# EAGLE design Nano_Wearable_Shield (EAGLE 9.1.3)
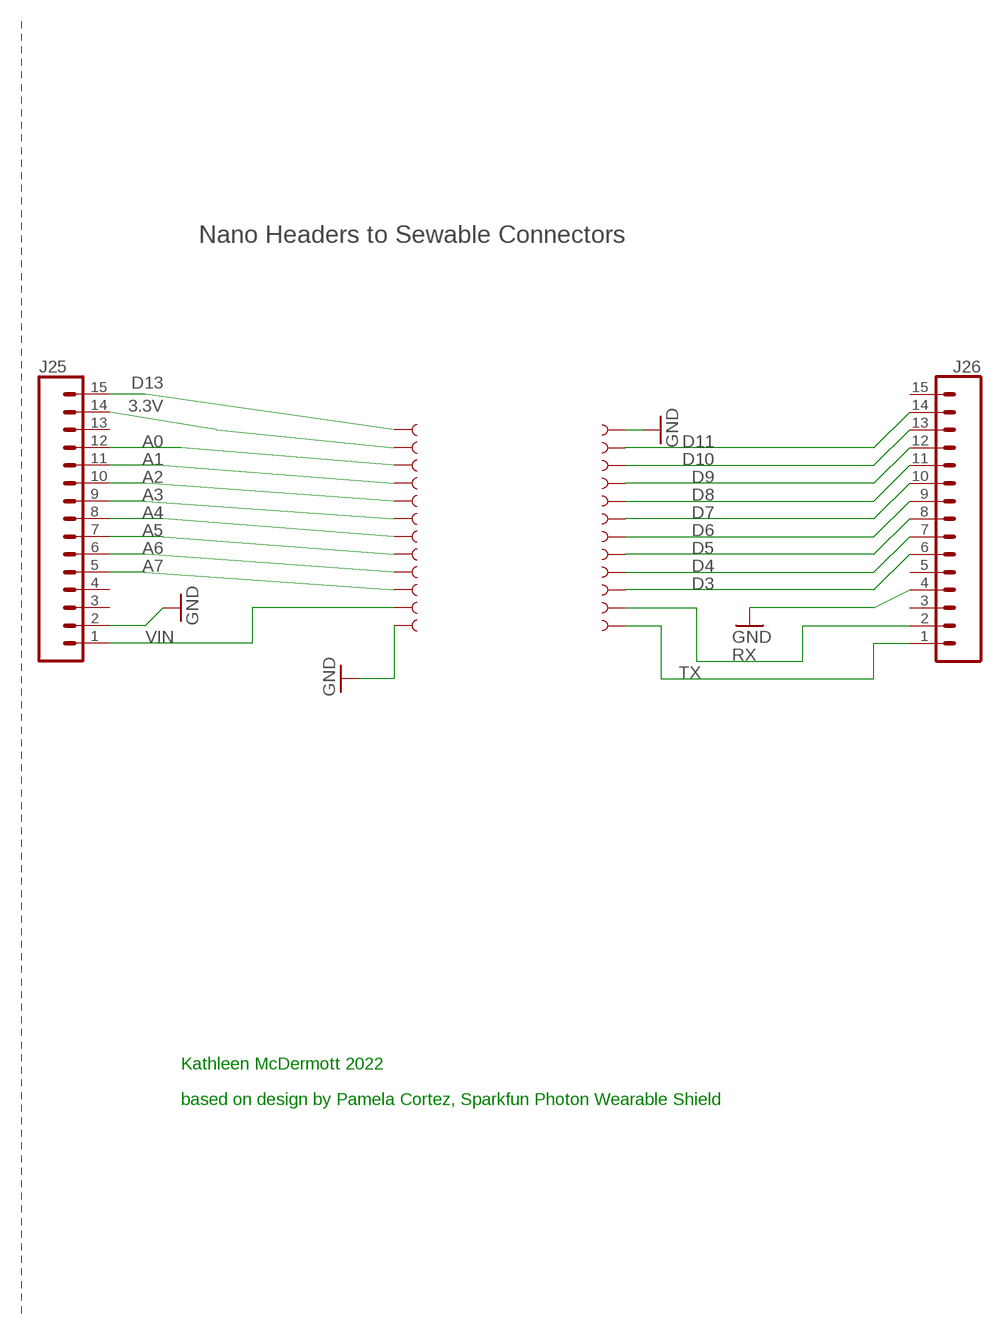
[diagram p0: schematic, sheet 1]

## Parts
J1  PAD  [PAD-LONG-2-SIDED]
J2  PAD  [PAD-LONG-2-SIDED]
J3  PAD  [PAD-LONG-2-SIDED]
J4  PAD  [PAD-LONG-2-SIDED]
J5  PAD  [PAD-LONG-2-SIDED]
J6  PAD  [PAD-LONG-2-SIDED]
J7  PAD  [PAD-LONG-2-SIDED]
J8  PAD  [PAD-LONG-2-SIDED]
J9  PAD  [PAD-LONG-2-SIDED]
J10  PAD  [PAD-LONG-2-SIDED]
J11  PAD  [PAD-LONG-2-SIDED]
J12  PAD  [PAD-LONG-2-SIDED]
J13  PAD  [PAD-LONG-2-SIDED]
J14  PAD  [PAD-LONG-2-SIDED]
J15  PAD  [PAD-LONG-2-SIDED]
J16  PAD  [PAD-LONG-2-SIDED]
J17  PAD  [PAD-LONG-2-SIDED]
J18  PAD  [PAD-LONG-2-SIDED]
J19  PAD  [PAD-LONG-2-SIDED]
J20  PAD  [PAD-LONG-2-SIDED]
J21  PAD  [PAD-LONG-2-SIDED]
J22  PAD  [PAD-LONG-2-SIDED]
J23  PAD  [PAD-LONG-2-SIDED]
J24  PAD  [PAD-LONG-2-SIDED]
J25  CONN_15  [1X15]
J26  CONN_15  [1X15]

## Nets
3.3V: J2.1 J25.14
A0: J3.1 J25.12
A1: J4.1 J25.11
A2: J5.1 J25.10
A3: J6.1 J25.9
A4: J7.1 J25.8
A5: J8.1 J25.7
A6: J9.1 J25.6
A7: J10.1 J25.5
D3: J22.1 J26.6
D4: J21.1 J26.7
D5: J20.1 J26.8
D6: J19.1 J26.9
D7: J18.1 J26.10
D8: J17.1 J26.11
D9: J16.1 J26.12
D10: J15.1 J26.13
D11: J14.1 J26.14
D13: J1.1 J25.15
GND: J12.1 J13.1 J25.2 J26.4
RX: J23.1 J26.2
TX: J24.1 J26.1
VIN: J11.1 J25.1
Unconnected: J25.3 J25.4 J25.13 J26.3 J26.5 J26.15

## Notes on the sheet
- Nano Headers to Sewable Connectors
- Kathleen McDermott 2022
- based on design by Pamela Cortez, Sparkfun Photon Wearable Shield

## Library data of the parts
J1-J24 = Photon_wearable:PAD
J25 J26 = SparkFun-Connectors:CONN_15: Multi connection point. Often used as Generic Header-pin footprint for 0.1 inch spaced/style header connections On any of the 0.1 inch spaced packages, you can populate with these: Break Away Headers - Straight <https://www.sparkfun.com/products/116> (PRT-00116) Break Away Male Headers - Right Angle <https://www.sparkfun.com/products/553> (PRT-00553) Female Headers <https://www.sparkfun.com/products/115> (PRT-00115) Break Away Headers - Machine Pin <https://www.sparkfun.com/products/117> (PRT-00117) Break Away Female Headers - Swiss Machine Pin <https://www.sparkfun.com/products/743> (PRT-00743) For SCREWTERMINALS and SPRING TERMINALS visit here: Screw Terimnals on SparkFun.com <https://www.sparkfun.com/search/results?term=Screw+Terminals> (5mm/3.5mm/2.54mm spacing) This device is also useful as a general connection point to wire up your design to another part of your project. Our various solder wires solder well into these plated through hole pads. Hook-Up Wire - Assortment (Stranded, 22 AWG) <https://www.sparkfun.com/products/11375> (PRT-11375) Hook-Up Wire - Assortment (Solid Core, 22 AWG) <https://www.sparkfun.com/products/11367> (PRT-11367) View the entire wire category on our website here <https://www.sparkfun.com/categories/141> Special notes: Molex polarized connector foot print use with SKU : PRT-08231 with associated crimp pins and housings. 1MM SMD Version SKU: PRT-10208 NOTES ON THE VARIANTS LOCK and LOCK_LONGPADS... This footprint was designed to help hold the alignment of a through-hole component (i.e. 6-pin header) while soldering it into place. You may notice that each hole has been shifted either up or down by 0.005 of an inch from it's more standard position (which is a perfectly straight line). This slight alteration caused the pins (the squares in the middle) to touch the edges of the holes. Because they are alternating, it causes a "brace" to hold the component in place. 0.005 has proven to be the perfect amount of "off-center" position when using our standard breakaway headers. Although looks a little odd when you look at the bare footprint, once you have a header in there, the alteration is very hard to notice. Also,if you push a header all the way into place, it is covered up entirely on the bottom side.

## Board
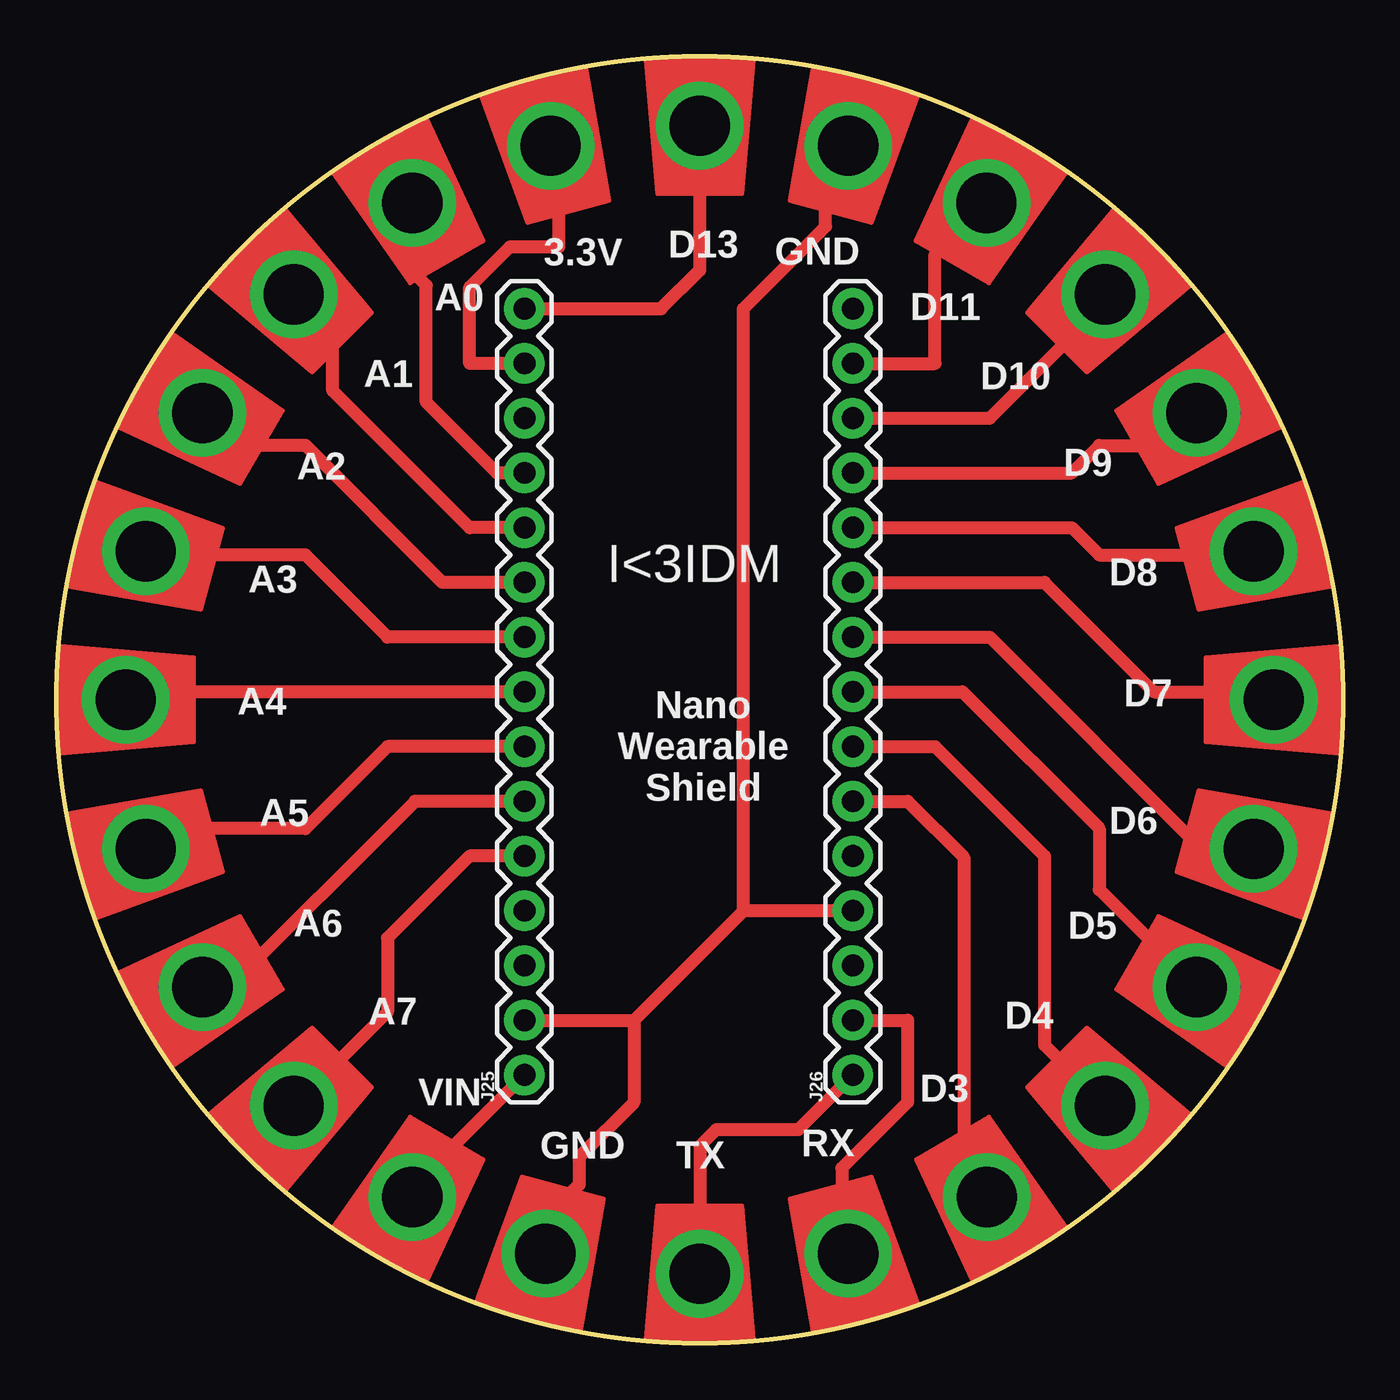
[diagram p1: board, top side]
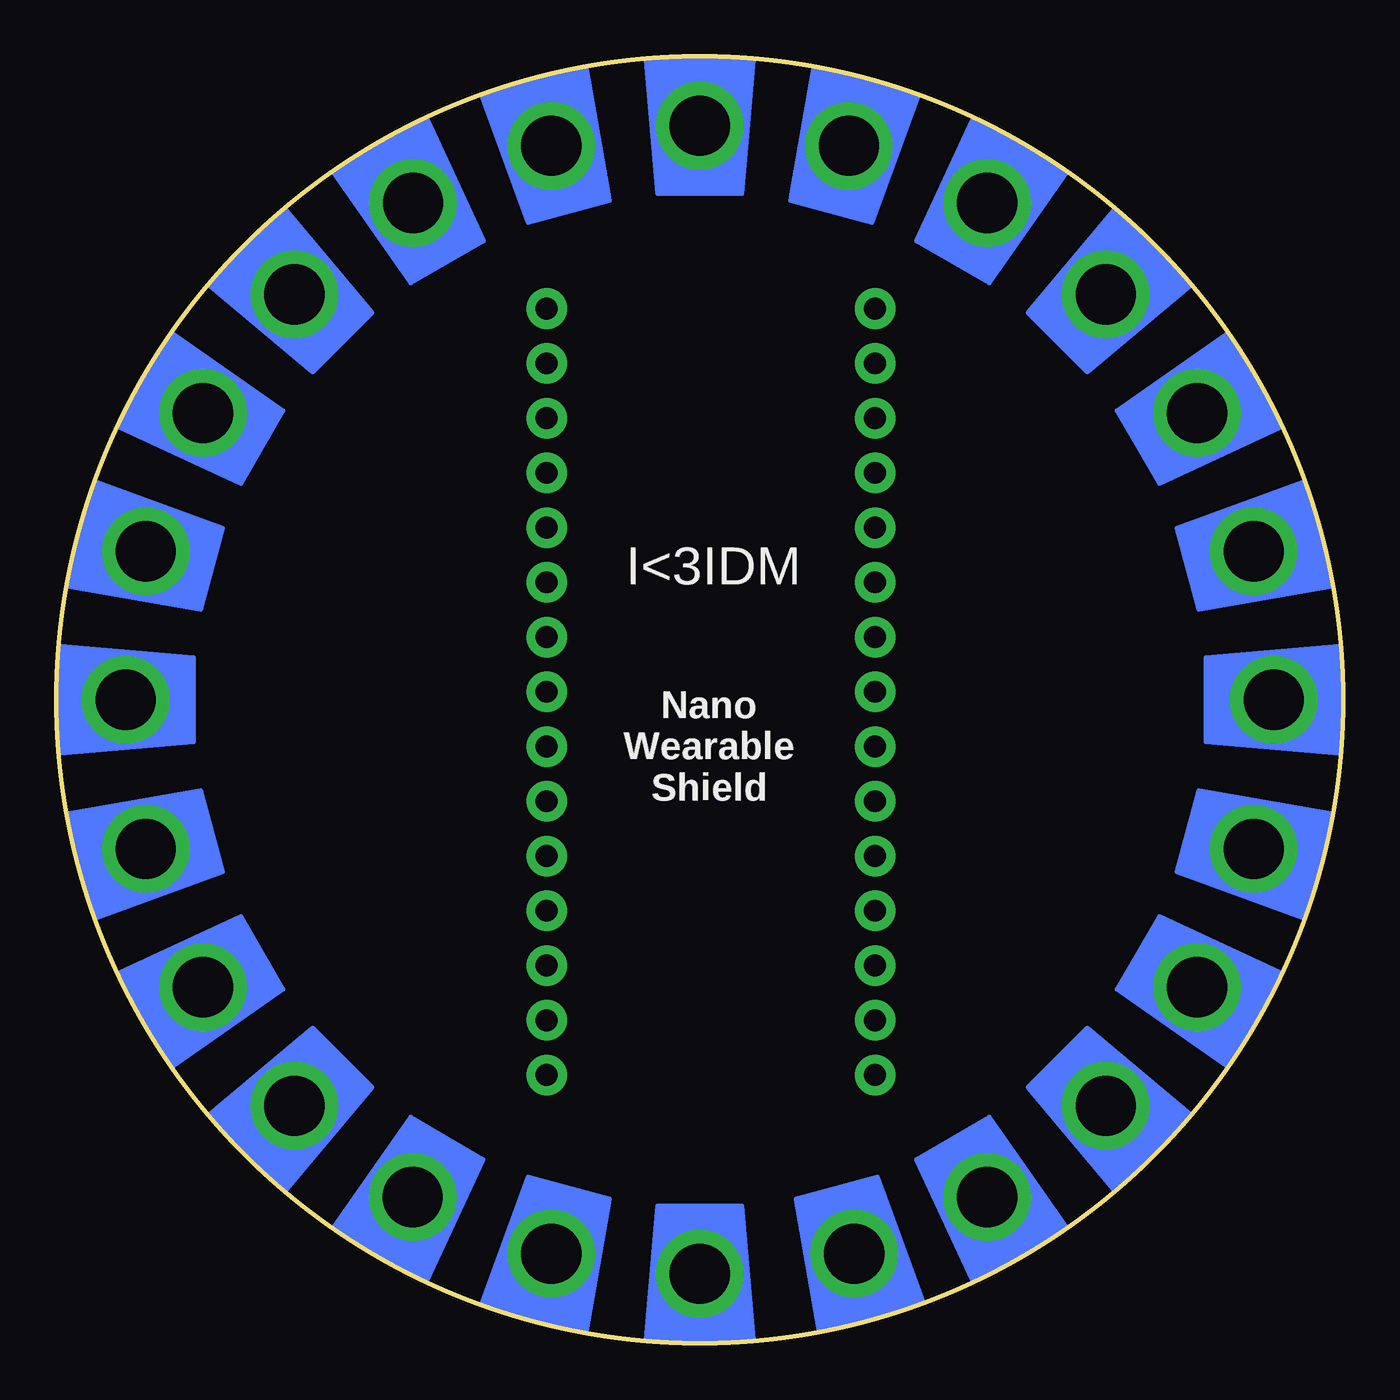
[diagram p2: board, bottom side, seen from below]

Size 59.69 x 59.69 mm. Coordinates in mm from the lower left corner, seen from the top.
Outline: circle at 29.84,29.84 radius 29.84
Copper layers (1*16): Top 0.035mm / dielectric 1.5mm / Bottom 0.035mm
Design rules "default *": minimum track width 10mil, minimum drill 24mil, track to track 8mil, track to pad 8mil, pad to pad 8mil, via to via 8mil, smd to smd 8mil, copper to edge 40mil, drill to drill 8mil, minimum pad ring 10mil, minimum via ring 8mil, stop-mask expansion 4mil, vias tented up to drill 0mil, thermal gap 10mil

### Footprints (pad centres in the part's own frame; a part is rotated, then mirrored left to right if it is on the bottom)
PAD-LONG-2-SIDED = drill 2.794 pad 4.064: 1 3.205,0
1X15 = drill 1.016 pad 1.88: 1 0,0; 2 2.54,0; 3 5.08,0; 4 7.62,0; 5 10.16,0; 6 12.7,0; 7 15.24,0; 8 17.78,0; 9 20.32,0; 10 22.86,0; 11 25.4,0; 12 27.94,0; 13 30.48,0; 14 33.02,0; 15 35.56,0

### Placement (x,y rotation side)
J1  29.84,59.69 270 top
J2  22.1,58.65 285 top
J3  14.91,55.68 300 top
J4  8.74,50.93 315 top
J5  3.99,44.75 330 top
J6  1.04,37.57 345 top
J7  0,29.84 0 top
J8  1.04,22.1 15 top
J9  3.99,14.91 30 top
J10  8.74,8.74 45 top
J11  14.91,3.99 60 top
J12  21.84,1.04 75 top
J13  37.57,58.65 255 top
J14  44.75,55.68 240 top
J15  50.93,50.93 225 top
J16  55.68,44.75 210 top
J17  58.65,37.57 195 top
J18  59.69,29.84 180 top
J19  58.65,22.1 165 top
J20  55.68,14.91 150 top
J21  50.93,8.74 135 top
J22  44.77,3.99 120 top
J23  37.57,1.04 105 top
J24  29.84,0 90 top
J25  21.71,12.43 90 top
J26  36.95,12.43 90 top

### Tracks (layer width: path | path; a pad name or v marks a point on that pad's centre or on a via)
3.3V
  Top 0.61: J25.14 19.17,45.45 19.17,49 21.04,50.87 23.31,50.87 23.31,55.17 J2.1
A0
  Top 0.61: J25.12 20.44,40.37 17.16,43.66 17.16,49.08 16.51,49.72 J3.1
A1
  Top 0.61: J25.11 19.17,37.83 12.82,44.18 12.82,47.99 11.67,47.99 J4.1
A2
  Top 0.61: J25.10 17.9,35.29 11.55,41.64 7.74,41.64 6.47,42.91 6.53,42.91 J5.1
A3
  Top 0.61: J25.9 15.36,32.75 11.55,36.56 3.93,36.56 3.96,36.56 J6.1
A4
  Top 0.61: J25.8 3.57,30.21 J7.1
A5
  Top 0.61: J25.7 15.36,27.67 11.55,23.86 5.2,23.86 3.93,22.59 4.14,22.8 J8.1
A6
  Top 0.61: J9.1 7.03,16.24 7.74,16.24 16.63,25.13 J25.6
A7
  Top 0.61: J25.5 19.17,22.59 15.36,18.78 15.36,15.36 J10.1
D3
  Top 0.61: J26.6 39.49,25.13 42.1,22.52 42.1,7.83 J22.1
D4
  Top 0.61: J26.7 40.76,27.67 45.84,22.59 45.84,13.83 J21.1
D5
  Top 0.61: J26.8 42.03,30.21 48.38,23.86 48.38,21.03 J20.1
D6
  Top 0.61: J26.9 43.3,32.75 53.13,22.93 J19.1
D7
  Top 0.61: J26.10 45.84,35.29 50.92,30.21 56.12,30.21 J18.1
D8
  Top 0.61: J26.11 47.11,37.83 48.38,36.56 55.38,36.56 J17.1
D9
  Top 0.61: J16.1 51.39,41.64 48.38,41.64 47.11,40.37 J26.12
D10
  Top 0.61: J26.13 43.3,42.91 48.66,48.28 J15.1
D11
  Top 0.61: J26.14 40.76,45.45 40.76,50.51 J14.1
D13
  Top 0.61: J25.15 28.06,47.99 29.84,49.78 J1.1
GND
  Top 0.61: J25.2 26.79,14.97 | 26.79,14.97 26.79,11.16 24.25,8.62 24.25,7.35 22.67,5.78 23.49,4.96 J12.1 | J13.1 35.68,54.49 35.68,51.8 31.87,47.99 31.87,20.05 | J26.4 31.87,20.05 | 31.87,20.05 26.79,14.97
RX
  Top 0.61: J26.2 39.49,14.97 39.49,11.16 36.44,8.11 36.44,4.05 36.74,3.76 | 36.95,3.54 36.74,3.76 | 36.74,3.76 J23.1
TX
  Top 0.61: J26.1 34.41,9.89 30.6,9.89 29.84,9.14 J24.1
VIN
  Top 0.61: J25.1 16.51,7.24 J11.1

### Text on the board
tPlace: 3.3V | D13 | GND | A0 | D11 | A1 | D10 | A2 | D9 | A3 | I<3IDM | D8 | A4 | D7 | Nano / Wearable / Shield | A5 | D6 | A6 | D5 | A7 | D4 | VIN | D3 | RX | GND | TX
bPlace: I<3IDM | Nano / Wearable / Shield